# EAGLE design Ariel v3 (EAGLE 9.3.0)
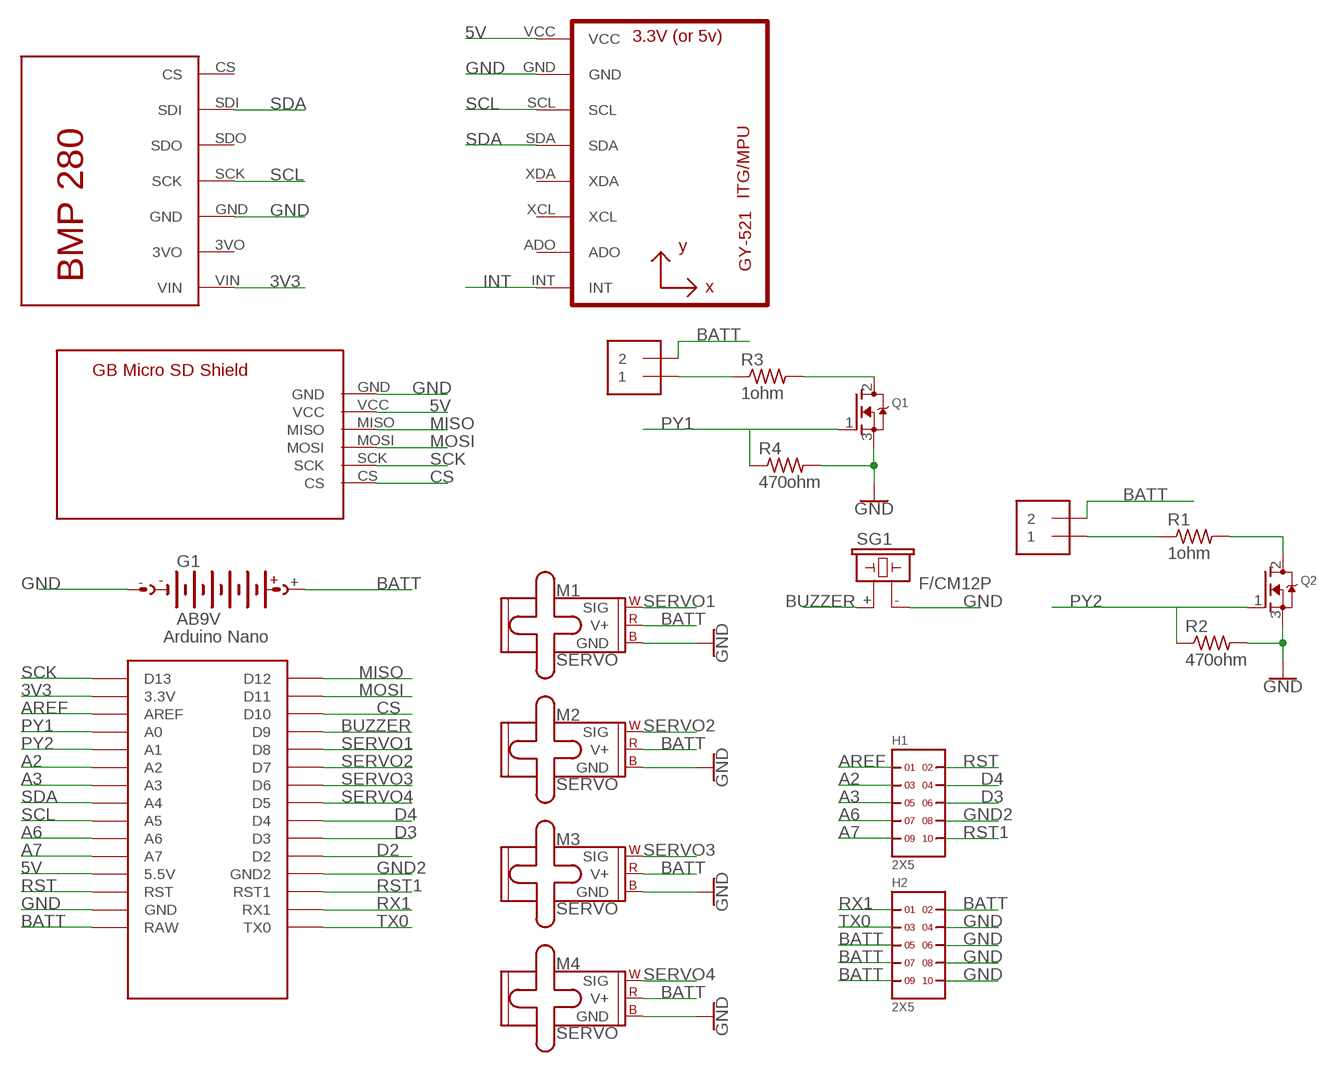
[diagram p0: schematic, sheet 1]

## Parts
G1  AB9V  [AB9V]
H1  2X5  [2X5]
H2  2X5  [2X5]
J1  1X2-3.5MM  [1X2-3.5MM]
J2  1X2-3.5MM  [1X2-3.5MM]
M1  SERVO  [1X03]
M2  SERVO  [1X03]
M3  SERVO  [1X03]
M4  SERVO  [1X03]
Q1  MOSFET-NGDS_TO220V  [TO220V]
Q2  MOSFET-NGDS_TO220V  [TO220V]
R1  1ohm  FLIPFLOP-RES  [0805-THM]
R2  470ohm  FLIPFLOP-RES  [0805-THM]
R3  1ohm  FLIPFLOP-RES  [0805-THM]
R4  470ohm  FLIPFLOP-RES  [0805-THM]
SG1  F/CM12P  [F/CM12P]
U1  GY-521MPU6050  [GY-521]
U$1  NANO  [NANO]
U$2  BMP280  [BMP280]
U$3  GBMICROSDSHIELD  [GBMICROSDSHIELD]

## Nets
3V3: U$1.3.3V U$2.VIN
5V: U1.VCC U$1.5V(5.5V) U$3.VCC
A2: H1.3 U$1.A2
A3: H1.5 U$1.A3
A6: H1.7 U$1.A6
A7: H1.9 U$1.A7
AREF: H1.1 U$1.AREF
BATT: G1.+ H2.2 H2.5 H2.7 H2.9 J1.2 J2.2 M1.2(V+) M2.2(V+) M3.2(V+) M4.2(V+) U$1.RAW
BUZZER: SG1.+ U$1.D9
CS: U$1.D10 U$3.CS
D2: U$1.D2
D3: H1.6 U$1.D3
D4: H1.4 U$1.D4
GND: G1.- H2.4 H2.6 H2.8 H2.10 M1.3(GND) M2.3(GND) M3.3(GND) M4.3(GND) Q1.3(S) Q2.3(S) R2.2 R4.2 SG1.- U1.GND U$1.GND U$2.GND U$3.GND
GND2: H1.8 U$1.GND1(GND2)
INT: U1.INT
MISO: U$1.D12 U$3.MISO
MOSI: U$1.D11 U$3.MOSI
N$1: J1.1 R1.1
N$2: Q2.2(D) R1.2
N$4: J2.1 R3.1
N$5: Q1.2(D) R3.2
PY1: Q1.1(G) R4.1 U$1.A0
PY2: Q2.1(G) R2.1 U$1.A1
RST: H1.2 U$1.RST
RST1: H1.10 U$1.RST1
RX1: H2.1 U$1.RX1
SCK: U$1.D13 U$3.SCK
SCL: U1.SCL U$1.A5 U$2.SCK
SDA: U1.SDA U$1.A4 U$2.SDI
SERVO1: M1.1(SIG) U$1.D8
SERVO2: M2.1(SIG) U$1.D7
SERVO3: M3.1(SIG) U$1.D6
SERVO4: M4.1(SIG) U$1.D5
TX0: H2.3 U$1.TX0
Unconnected: U1.ADO U1.XCL U1.XDA U$1.ICSP1 U$1.ICSP2 U$1.ICSP3 U$1.ICSP4 U$1.ICSP5 U$1.ICSP6 U$2.3VO U$2.CS U$2.SDO

## Library data of the parts
G1 = battery:AB9V: 9-V BATTERY CLIP
H1 H2 = headers(.1in):2X5
J1 J2 = adafruit:1X2: 3.5mm Terminal block http://www.ladyada.net/library/pcb/eaglelibrary.html
M1-M4 = SparkFun-Electromechanical:SERVO: Servo Motor 3-pin connector for a standard servo motor (voltage supply, ground, and control signal.) SparkFun Products Servo - Generic (Sub-Micro Size) <https://www.sparkfun.com/products/9065> (ROB-09065) Servo - Generic High Torque Continuous Rotation (Standard Size) <https://www.sparkfun.com/products/9347> (ROB-09347) Servo - Generic High Torque (Standard Size) <https://www.sparkfun.com/products/11965> (ROB-11965)
Q1 Q2 = adafruit:MOSFET-N: N-Channel Mosfet 2N7002E - 60V 260mA SOT23 [Digikey: 2N7002ET1GOSTR-ND] - REEL BSH103 - 30V 850mA SOT23 [Digikey: 568-5013-1-ND]
R1-R4 = adafruit:FLIPFLOP-RES: Flip Flop resistor An 0805 resistor inside a standard 1/4W 5% resistor. Makes for easy mods
SG1 = buzzer:F/CM12P: BUZZER Source: Buerklin; OC_FARNELL: unknown; OC_NEWARK: unknown
U1 = gy-521:GY-521
U$1 = Arduino-clone:NANO: Arduino Nano
U$2 = BMP280:BMP280
U$3 = GB Micro SD Card Shield:GBMICROSDSHIELD

## Board
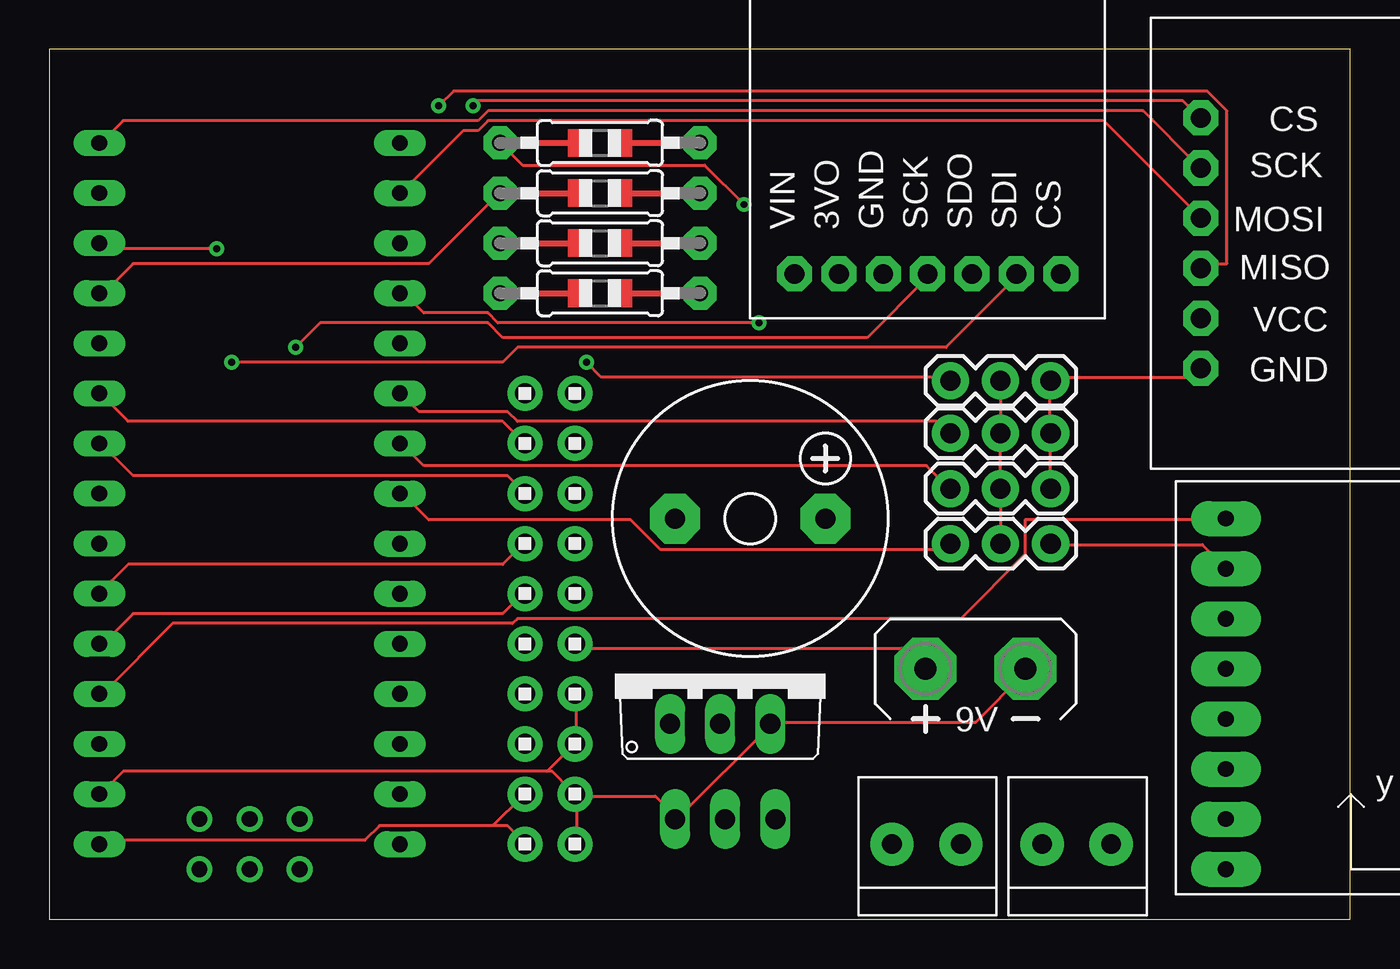
[diagram p1: board, top side]
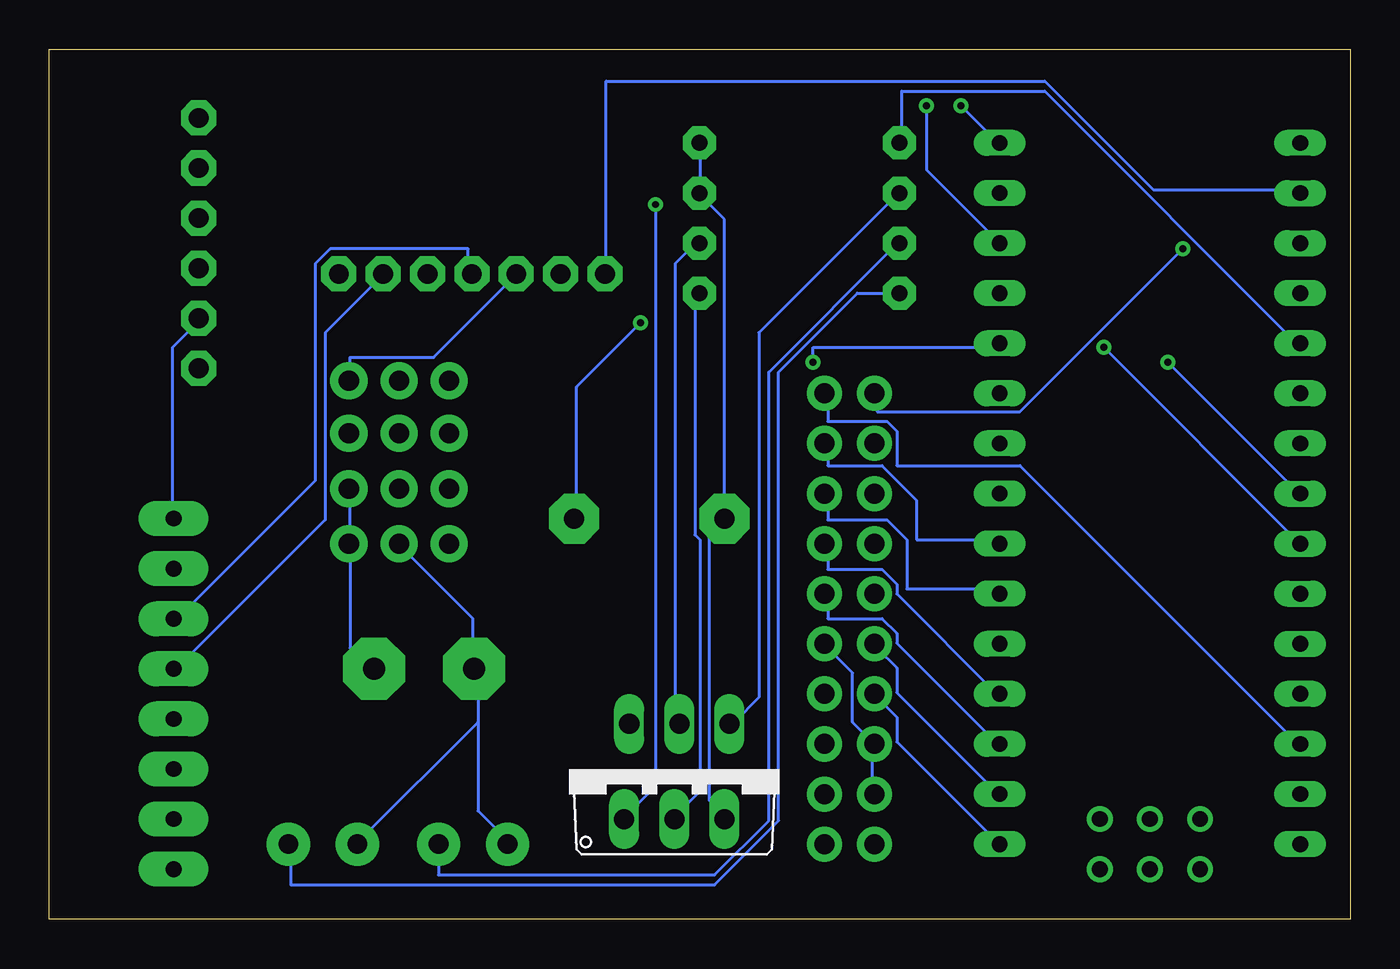
[diagram p2: board, bottom side, seen from below]

Size 66 x 44.12 mm. Coordinates in mm from the lower left corner, seen from the top.
Outline: 0,0 66,0 66,44.12 0,44.12 0,0
Copper layers (1*16): Top 0.035mm / dielectric 1.5mm / Bottom 0.035mm
Design rules "default": minimum track width 6mil, minimum drill 0.35mm, track to track 6mil, track to pad 6mil, pad to pad 6mil, via to via 6mil, smd to smd 6mil, copper to edge 40mil, drill to drill 6mil, minimum pad ring 10mil, minimum via ring 8mil, stop-mask expansion 4mil, vias tented up to drill 0mil, thermal gap 10mil

### Footprints (pad centres in the part's own frame; a part is rotated, then mirrored left to right if it is on the bottom)
AB9V = drill 1.118 pad 3.15 octagon: + 0,2.54; - 0,-2.54
2X5 = drill 1.016 pad 1.778: 1 0,0; 2 0,2.54; 3 2.54,0; 4 2.54,2.54; 5 5.08,0; 6 5.08,2.54; 7 7.62,0; 8 7.62,2.54; 9 10.16,0; 10 10.16,2.54
1X2-3.5MM = drill 1 pad 2.184: 1 1.8,0; 2 -1.7,0
1X03 = drill 1.016 pad 1.88: 1 0,0; 2 2.54,0; 3 5.08,0
TO220V = drill 1.016 long: 1 -2.54,-2.54; 2 0,-2.54; 3 2.54,-2.54
0805-THM = drill 0.813 pad 1.676 octagon: 1 -5.08,0; 2 5.08,0
F/CM12P = drill 1.016 pad 2.54 octagon: + 3.81,0; - -3.81,0
GY-521 = drill 0.8 pad 1.778 long: ADO -8.89,-6.35; GND -8.89,6.35; INT -8.89,-8.89; SCL -8.89,3.81; SDA -8.89,1.27; VCC -8.89,8.89; XCL -8.89,-3.81; XDA -8.89,-1.27
NANO = drill 0.8 long: 3.3V -10.16,24.13; 5V -10.16,-1.27; A0 -10.16,19.05; A1 -10.16,16.51; A2 -10.16,13.97; A3 -10.16,11.43; A4 -10.16,8.89; A5 -10.16,6.35; A6 -10.16,3.81; A7 -10.16,1.27; AREF -10.16,21.59; D2 5.08,1.27; D3 5.08,3.81; D4 5.08,6.35; D5 5.08,8.89; D6 5.08,11.43; D7 5.08,13.97; D8 5.08,16.51; D9 5.08,19.05; D10 5.08,21.59; D11 5.08,24.13; D12 5.08,26.67; D13 -10.16,26.67; GND -10.16,-6.35; GND1 5.08,-1.27; RAW -10.16,-8.89; RST -10.16,-3.81; RST1 5.08,-3.81; RX1 5.08,-6.35; TX0 5.08,-8.89 | drill 0.8: ICSP1 -5.08,-10.16; ICSP2 -5.08,-7.62; ICSP3 -2.54,-10.16; ICSP4 -2.54,-7.62; ICSP5 0,-10.16; ICSP6 0,-7.62
BMP280 = drill 1 pad 1.778 octagon: 3VO 4.5,2.25; CS 15.75,2.25; GND 6.75,2.25; SCK 9,2.25; SDI 13.5,2.25; SDO 11.25,2.25; VIN 2.25,2.25
GBMICROSDSHIELD = drill 1 pad 1.778 octagon: CS 38.1,5.08; GND 38.1,17.78; MISO 38.1,12.7; MOSI 38.1,10.16; SCK 38.1,7.62; VCC 38.1,15.24

### Placement (x,y rotation side)
G1  46.99,12.7 90 top
H1  24.13,26.67 270 top
H2  24.13,13.97 270 top
J1  52.07,3.81 0 top
J2  44.45,3.81 0 top
M1  45.72,27.3 0 top
M2  45.72,24.64 0 top
M3  45.72,21.84 0 top
M4  45.72,19.05 0 top
Q1  34.04,12.45 0 top
Q2  34.29,7.62 0 bottom
R1  27.94,31.75 0 top
R2  27.94,39.37 0 top
R3  27.94,34.29 0 top
R4  27.94,36.83 0 top
SG1  35.56,20.32 0 top
U1  68.58,11.43 0 top
U$1  12.7,12.7 0 top
U$2  35.56,30.48 0 top
U$3  96.52,45.72 180 top

### Tracks (layer width: path | path; a pad name or v marks a point on that pad's centre or on a via)
3V3
  Bottom 0.152: U$1.3.3V 2.75,37 10,37 15.5,42.5 37.75,42.5 37.75,32.75 U$2.VIN
5V
  Top 0.152: U$1.5V 2.75,11.5 6.25,15 23.5,15 23.75,15.25 46.25,15.25 49.5,18.5 49.5,20.25 59.5,20.25 U1.VCC
  Bottom 0.152: U$3.VCC 58.5,30.25 59.75,29 59.75,20.5 U1.VCC
A2
  Top 0.152: U$1.A2 2.75,26.5 4,25.25 23,25.25 24,24.25 H1.3
A3
  Top 0.152: U$1.A3 2.75,24 4.25,22.5 23.25,22.5 24,21.75 H1.5
A6
  Top 0.152: U$1.A6 2.75,16.75 4,18 23,18 24,19 H1.7
A7
  Top 0.152: U$1.A7 2.75,14 4.25,15.5 23,15.5 24,16.5 H1.9
AREF  (via drill 0.35)
  Top 0.152: v8.5,34 3,34 2.75,34.25 U$1.AREF
  Bottom 0.152: v8.5,34 16.75,25.75 24,25.75 24,26.5 H1.1
BATT
  Top 0.152: M1.2 48.25,27.25 48.25,24.75 M2.2 48.25,24.5 48.25,22 M3.2 48.25,21.75 48.25,19.25 M4.2 | 22.5,4.75 23.25,4.75 24,4 H2.9 | 22.5,4.75 16.75,4.75 16,4 2.75,4 U$1.RAW | 22.5,4.75 24,6.25 H2.7 | G1.+ 44.25,12.75 43.25,13.75 26.75,13.75 H2.2
  Bottom 0.152: 44.25,10 44.25,12.5 G1.+ 44.5,12.75 44.5,15.25 48.25,19 M4.2 | 44.25,10 44.25,5.5 42.75,4 J2.2 | 44.25,10 50.25,4 J1.2 | H2.7 24.25,6.5 24.25,8.75 H2.5 24.25,9 25.25,10 25.25,12.5 26.5,13.75 H2.2
BUZZER  (via drill 0.35)
  Top 0.152: v36,30.25 22.75,30.25 22.25,30.75 19,30.75 18,31.75 U$1.D9
  Bottom 0.152: v36,30.25 39.25,27 39.25,20.5 SG1.+
CS  (via drill 0.35)
  Top 0.152: v21.5,41.25 21.75,41.5 57.5,41.5 58.25,40.75 U$3.CS
  Bottom 0.152: v21.5,41.25 21.5,38 18,34.5 U$1.D10
D3
  Bottom 0.152: U$1.D3 18,16.75 22.5,16.75 22.5,19.25 23.5,20.25 26.5,20.25 26.5,21.5 H1.6
D4
  Bottom 0.152: U$1.D4 18,19.25 22,19.25 22,21.25 23.75,23 26.5,23 26.5,24 H1.4
GND
  Top 0.152: U$3.GND 58.25,27.75 58,27.5 51,27.5 M1.3 50.75,27.25 50.75,24.75 M2.3 50.75,24.5 50.75,22 M3.3 | U1.GND 59.5,18 58.5,19 51,19 M4.3 | 25.25,7.5 25.5,7.5 26.5,6.5 H2.8 26.75,6.25 | 25.25,7.5 3.75,7.5 2.75,6.5 U$1.GND | 31.75,5.25 30.75,6.25 26.75,6.25 | 31.75,5.25 32,5.25 36.5,9.75 Q1.3 36.75,10 47,10 49.5,12.5 G1.- | 31.75,5.25 Q2.3 | 26.75,6.25 26.75,4 H2.10 | 25.25,7.5 26.5,8.75 H2.6 26.75,9 26.75,11.25 H2.4
  Bottom 0.152: U$2.GND 42.5,32.5 46.5,28.5 50.75,28.5 50.75,27.5 M1.3 | M3.3 50.75,21.75 50.75,19.25 M4.3 50.75,19 50.75,13.75 49.75,12.75 G1.- | R2.2 33,39.25 33,37 R4.2 33,36.75 31.75,35.5 SG1.- 31.75,20.25 32.5,19.5 32.5,6 31.75,5.25 Q2.3
GND2
  Bottom 0.152: U$1.GND1 18,11.5 23,16.5 23,17 23.75,17.75 26.5,17.75 26.5,19 H1.8
MISO  (via drill 0.35)
  Top 0.152: v19.75,41.25 20.5,42 58.75,42 59.75,41 59.75,33.25 58.5,33.25 U$3.MISO
  Bottom 0.152: v19.75,41.25 18,39.5 U$1.D12
MOSI
  Top 0.152: U$1.D11 18,37 21,40 21.75,40 22.25,40.5 53.5,40.5 58.25,35.75 U$3.MOSI
N$1
  Bottom 0.152: R1.1 25,31.75 29,27.75 29,5 32.25,1.75 53.75,1.75 53.75,3.75 J1.1
N$2
  Bottom 0.152: Q2.2 34.25,5.25 33,6.5 33,19.25 33.25,19.5 33.25,31.75 R1.2
N$4
  Bottom 0.152: J2.1 46.25,2.25 32.25,2.25 29.5,5 29.5,27.75 23,34.25 R3.1
N$5
  Bottom 0.152: Q1.2 34.25,10 34.25,33.25 33.25,34.25 R3.2
PY1
  Top 0.152: U$1.A0 2.75,31.75 4.25,33.25 19.25,33.25 22.75,36.75 R4.1
  Bottom 0.152: Q1.1 31.25,10 30,11.25 30,29.75 23,36.75 R4.1
PY2  (via drill 0.35)
  Top 0.152: v35.25,36.25 33.25,38.25 24,38.25 23,39.25 R2.1
  Bottom 0.152: U$1.A1 2.75,29.25 15.5,42 22.75,42 22.75,39.5 R2.1 | v35.25,36.25 35.25,6.75 36.75,5.25 Q2.1
RST
  Bottom 0.152: U$1.RST 2.75,9 16.75,23 23,23 23,24.75 23.5,25.25 26.5,25.25 26.5,26.5 H1.2
RST1
  Bottom 0.152: U$1.RST1 18,9 23,14 23,14.5 23.75,15.25 26.5,15.25 26.5,16.5 H1.10
RX1
  Bottom 0.152: U$1.RX1 18,6.5 23,11.5 23,12.75 24,13.75 H2.1
SCK
  Top 0.152: U$1.D13 2.75,39.5 3.75,40.5 21.75,40.5 22.25,41 55.5,41 58.25,38.25 U$3.SCK
SCL  (via drill 0.35)
  Top 0.152: v12.5,29 13.75,30.25 22.25,30.25 23,29.5 41.5,29.5 44.5,32.5 U$2.SCK
  Bottom 0.152: v12.5,29 2.75,19.25 U$1.A5 | U1.SCL 59.5,15.25 52.5,22.25 52.5,33.25 51.75,34 44.75,34 44.75,32.75 U$2.SCK
SDA  (via drill 0.35)
  Top 0.152: v9.25,28.25 23,28.25 23.75,29 45.5,29 49,32.5 U$2.SDI
  Bottom 0.152: v9.25,28.25 2.75,21.75 U$1.A4 | U1.SDA 59.5,12.75 52,20.25 52,29.75 49.25,32.5 U$2.SDI
SERVO1  (via drill 0.35)
  Top 0.152: v27.25,28.25 28,27.5 45.5,27.5 M1.1
  Bottom 0.152: v27.25,28.25 27.25,29 18,29 U$1.D8
SERVO2
  Top 0.152: U$1.D7 18,26.5 18.75,25.75 23.25,25.75 23.75,25.25 45,25.25 45.5,24.75 M2.1
SERVO3
  Top 0.152: U$1.D6 18,24 19,23 44.5,23 45.5,22 M3.1
SERVO4
  Top 0.152: U$1.D5 18,21.5 19.25,20.25 29.5,20.25 31,18.75 45.25,18.75 45.5,19 M4.1
TX0
  Bottom 0.152: U$1.TX0 18,4 23,9 23,10.25 24,11.25 H2.3